# EAGLE design touch (EAGLE 7.2.0)
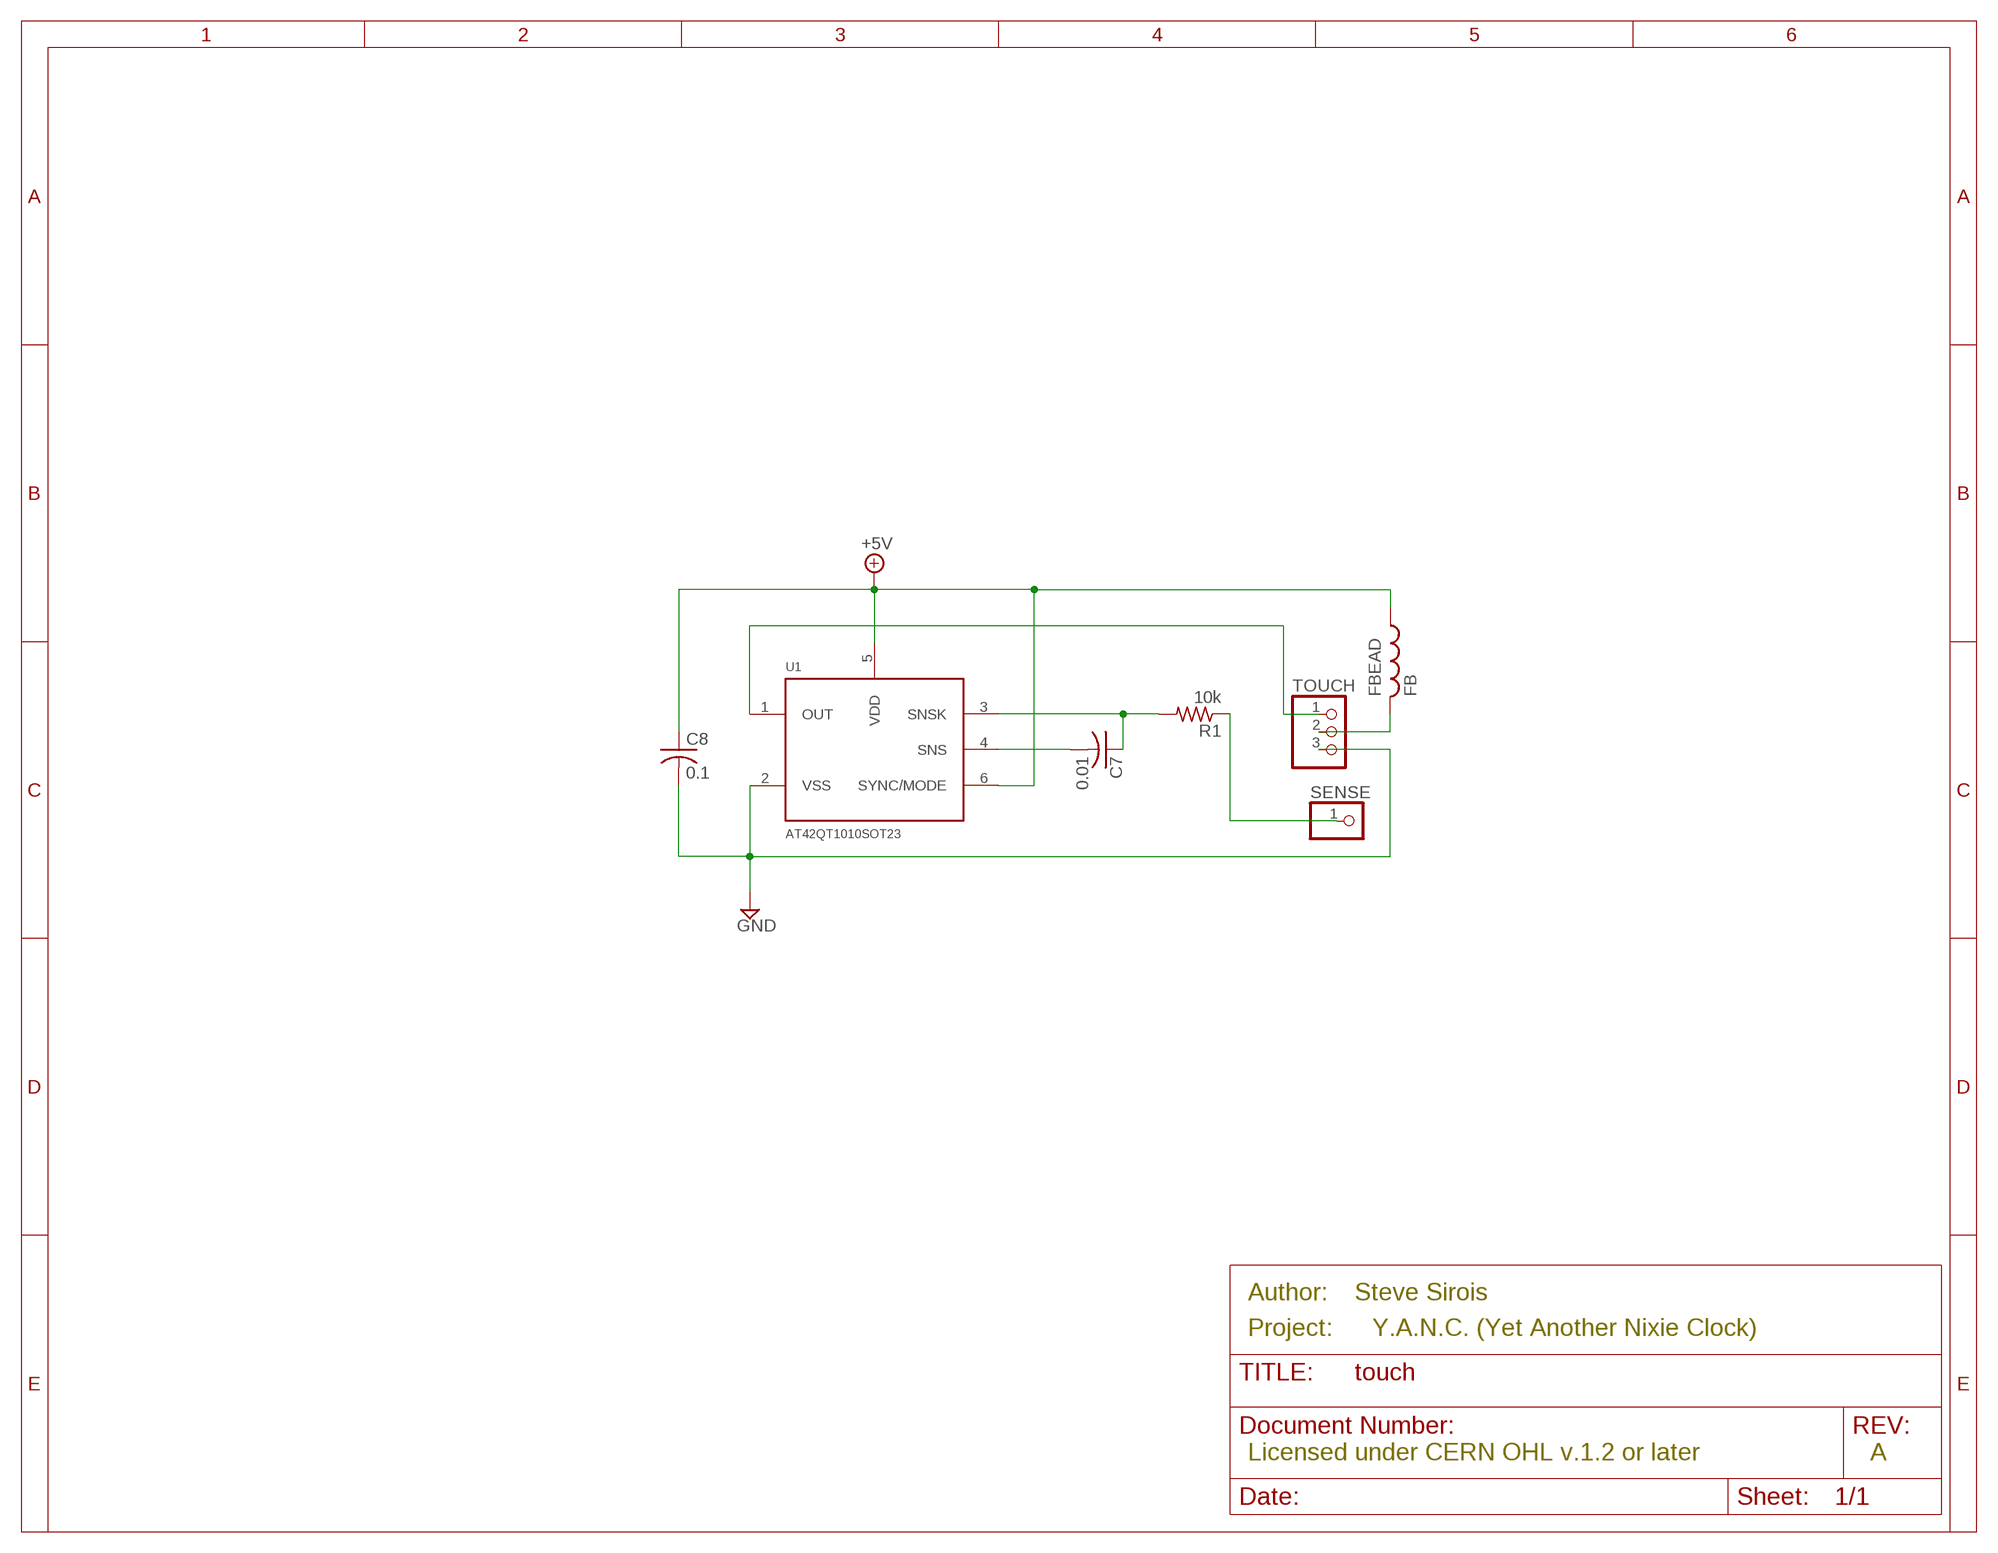
[diagram p0: schematic, sheet 1]

## Parts
C7  0.01  C-US025-025X050  [C025-025X050]
C8  0.1  C-US025-025X050  [C025-025X050]
FBEAD  FB  [FB]
R1  10k  R-US_0207/10  [0207/10]
SENSE  PINHD-1X1  [1X01]
TOUCH  PINHD-1X3  [1X03]
U1  AT42QT1010SOT23  [SOT23-6]

## Nets
+5V: C8.1 FBEAD.P$1 U1.5(VDD) U1.6(SYNC/MODE)
GND: C8.2 TOUCH.3 U1.2(VSS)
N$1: TOUCH.1 U1.1(OUT)
N$2: R1.1 SENSE.1
N$3: FBEAD.P$2 TOUCH.2
N$16: C7.1 R1.2 U1.3(SNSK)
N$17: C7.2 U1.4(SNS)

## Notes on the sheet
- Author: | Steve Sirois
- Project: | Y.A.N.C. (Yet Another Nixie Clock)
- Licensed under CERN OHL v.1.2 or later | A

## Library data of the parts
C7 C8 = rcl:C-US: CAPACITOR, American symbol
FBEAD = adafruit:FB: Ferrite bead Digikey #P9821BK-ND
R1 = resistor:R-US_: RESISTOR, American symbol
SENSE = adafruit:PINHD-1X1: Pin header 1x1 for 0.1" spacing With round pins
TOUCH = adafruit:PINHD-1X3: PIN HEADER
U1 = SparkFun-DigitalIC:AT42QT1010

## Net classes
0 default: clearance 0.205 mm

## Board
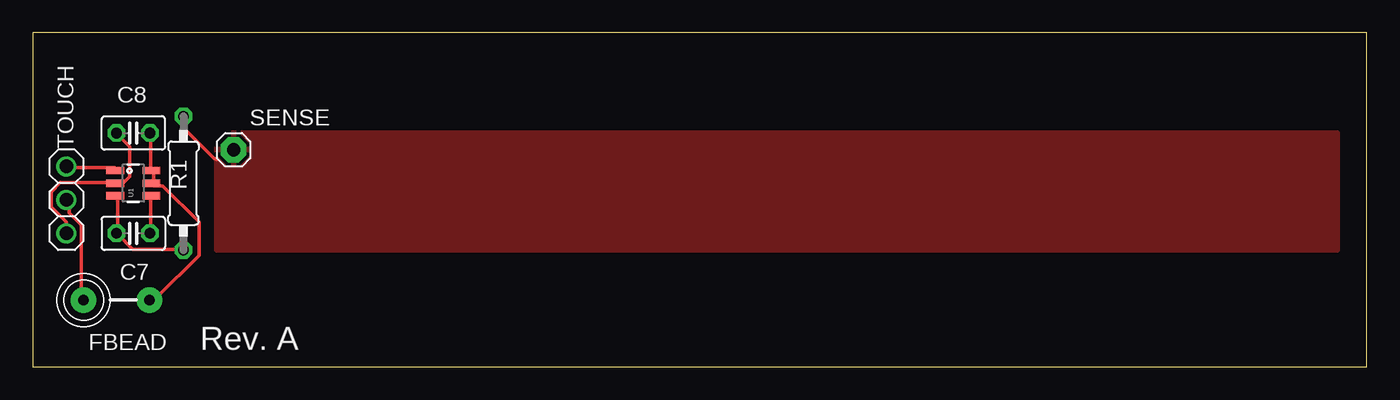
[diagram p1: board, top side]

Size 101.27 x 25.39 mm. Coordinates in mm from the lower left corner, seen from the top.
Outline: 0,0 101.27,0 101.27,25.39 0,25.39 0,0
Copper layers (1*16): Top 0.035mm / dielectric 1.5mm / Bottom 0.035mm
Design rules "default": minimum track width 10mil, minimum drill 24mil, track to track 8mil, track to pad 8mil, pad to pad 8mil, via to via 8mil, smd to smd 8mil, copper to edge 40mil, drill to drill 8mil, minimum pad ring 10mil, minimum via ring 8mil, stop-mask expansion 4mil, vias tented up to drill 0mil, thermal gap 10mil

### Footprints (pad centres in the part's own frame; a part is rotated, then mirrored left to right if it is on the bottom)
C025-025X050 = drill 0.813 octagon: 1 -1.27,0; 2 1.27,0
FB = drill 0.8 pad 1.93: P$1 -2.5,0; P$2 2.5,0
0207/10 = drill 0.813 octagon: 1 -5.08,0; 2 5.08,0
1X01 = drill 1.016 pad 1.93 octagon: 1 0,0
1X03 = drill 1.016: 1 -2.54,0; 2 0,0; 3 2.54,0
SOT23-6 = smd 0.55 x 1.35: 1 -0.95,-1.375; 2 0,-1.375; 3 0.95,-1.375; 4 0.95,1.375; 5 0,1.375; 6 -0.95,1.375

### Placement (x,y rotation side)
C7  7.62,10.16 0 top
C8  7.62,17.78 180 top
FBEAD  6.35,5.08 180 top
R1  11.43,13.97 270 top
SENSE  15.24,16.51 0 top
TOUCH  2.54,12.7 270 top
U1  7.62,13.97 270 top

### Tracks (layer width: path | path; a pad name or v marks a point on that pad's centre or on a via)
+5V
  Top 0.254: C8.1 8.95,17.67 8.95,15.15 U1.6 9.18,14.92 9.18,14 U1.5 9.18,13.77 9.87,13.77 12.62,11.02 12.62,8.49 9.41,5.28 8.95,5.28 FBEAD.P$1
GND
  Top 0.254: C8.2 6.43,17.67 7.34,16.75 7.34,14.46 6.88,14 6.43,14 U1.2 6.2,14 2.07,14 1.38,13.31 1.38,12.16 2.52,11.02 2.52,10.33 TOUCH.3
N$1
  Top 0.254: U1.1 6.2,15.15 2.75,15.15 TOUCH.1
N$2
  Top 0.254: R1.1 11.47,19.05 11.47,18.13 13.77,15.84 13.97,15.77
  pour Top: 13.97,17.78 13.97,8.89 99.06,8.89 99.06,17.78
N$3
  Top 0.254: TOUCH.2 2.75,12.62 2.75,11.7 3.67,10.79 3.67,5.28 FBEAD.P$2
N$16
  Top 0.254: U1.3 6.43,12.85 6.43,10.33 C7.1 6.43,10.1 7.57,8.95 11.24,8.95 R1.2
N$17
  Top 0.254: U1.4 8.95,12.85 8.95,10.33 C7.2

### Text on the board
tNames: Rev. A